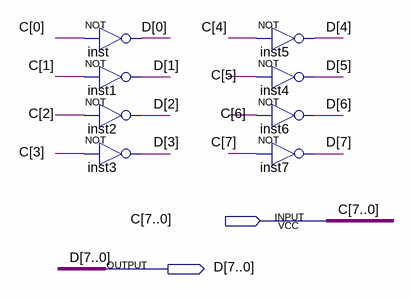
[diagram p0: schematic sheet]
// Quartus schematic DaoBit.bdf as structural Verilog: 8 symbols, 2 pins
module DaoBit (
  input  [7:0] C,
  output [7:0] D
);

  not inst (D[0], C[0]);
  not inst1 (D[1], C[1]);
  not inst2 (D[2], C[2]);
  not inst3 (D[3], C[3]);
  not inst5 (D[4], C[4]);
  not inst4 (D[5], C[5]);
  not inst6 (D[6], C[6]);
  not inst7 (D[7], C[7]);
endmodule
